# Altium schematic sheet rx_path.SchDoc: WULPUS PRO
size A3; DrawnBy: Sergei Vostrikov; Organization: Integrated Systems Laboratory; Revision: 1.0.0; SheetNumber: 2; SheetTotal: 8
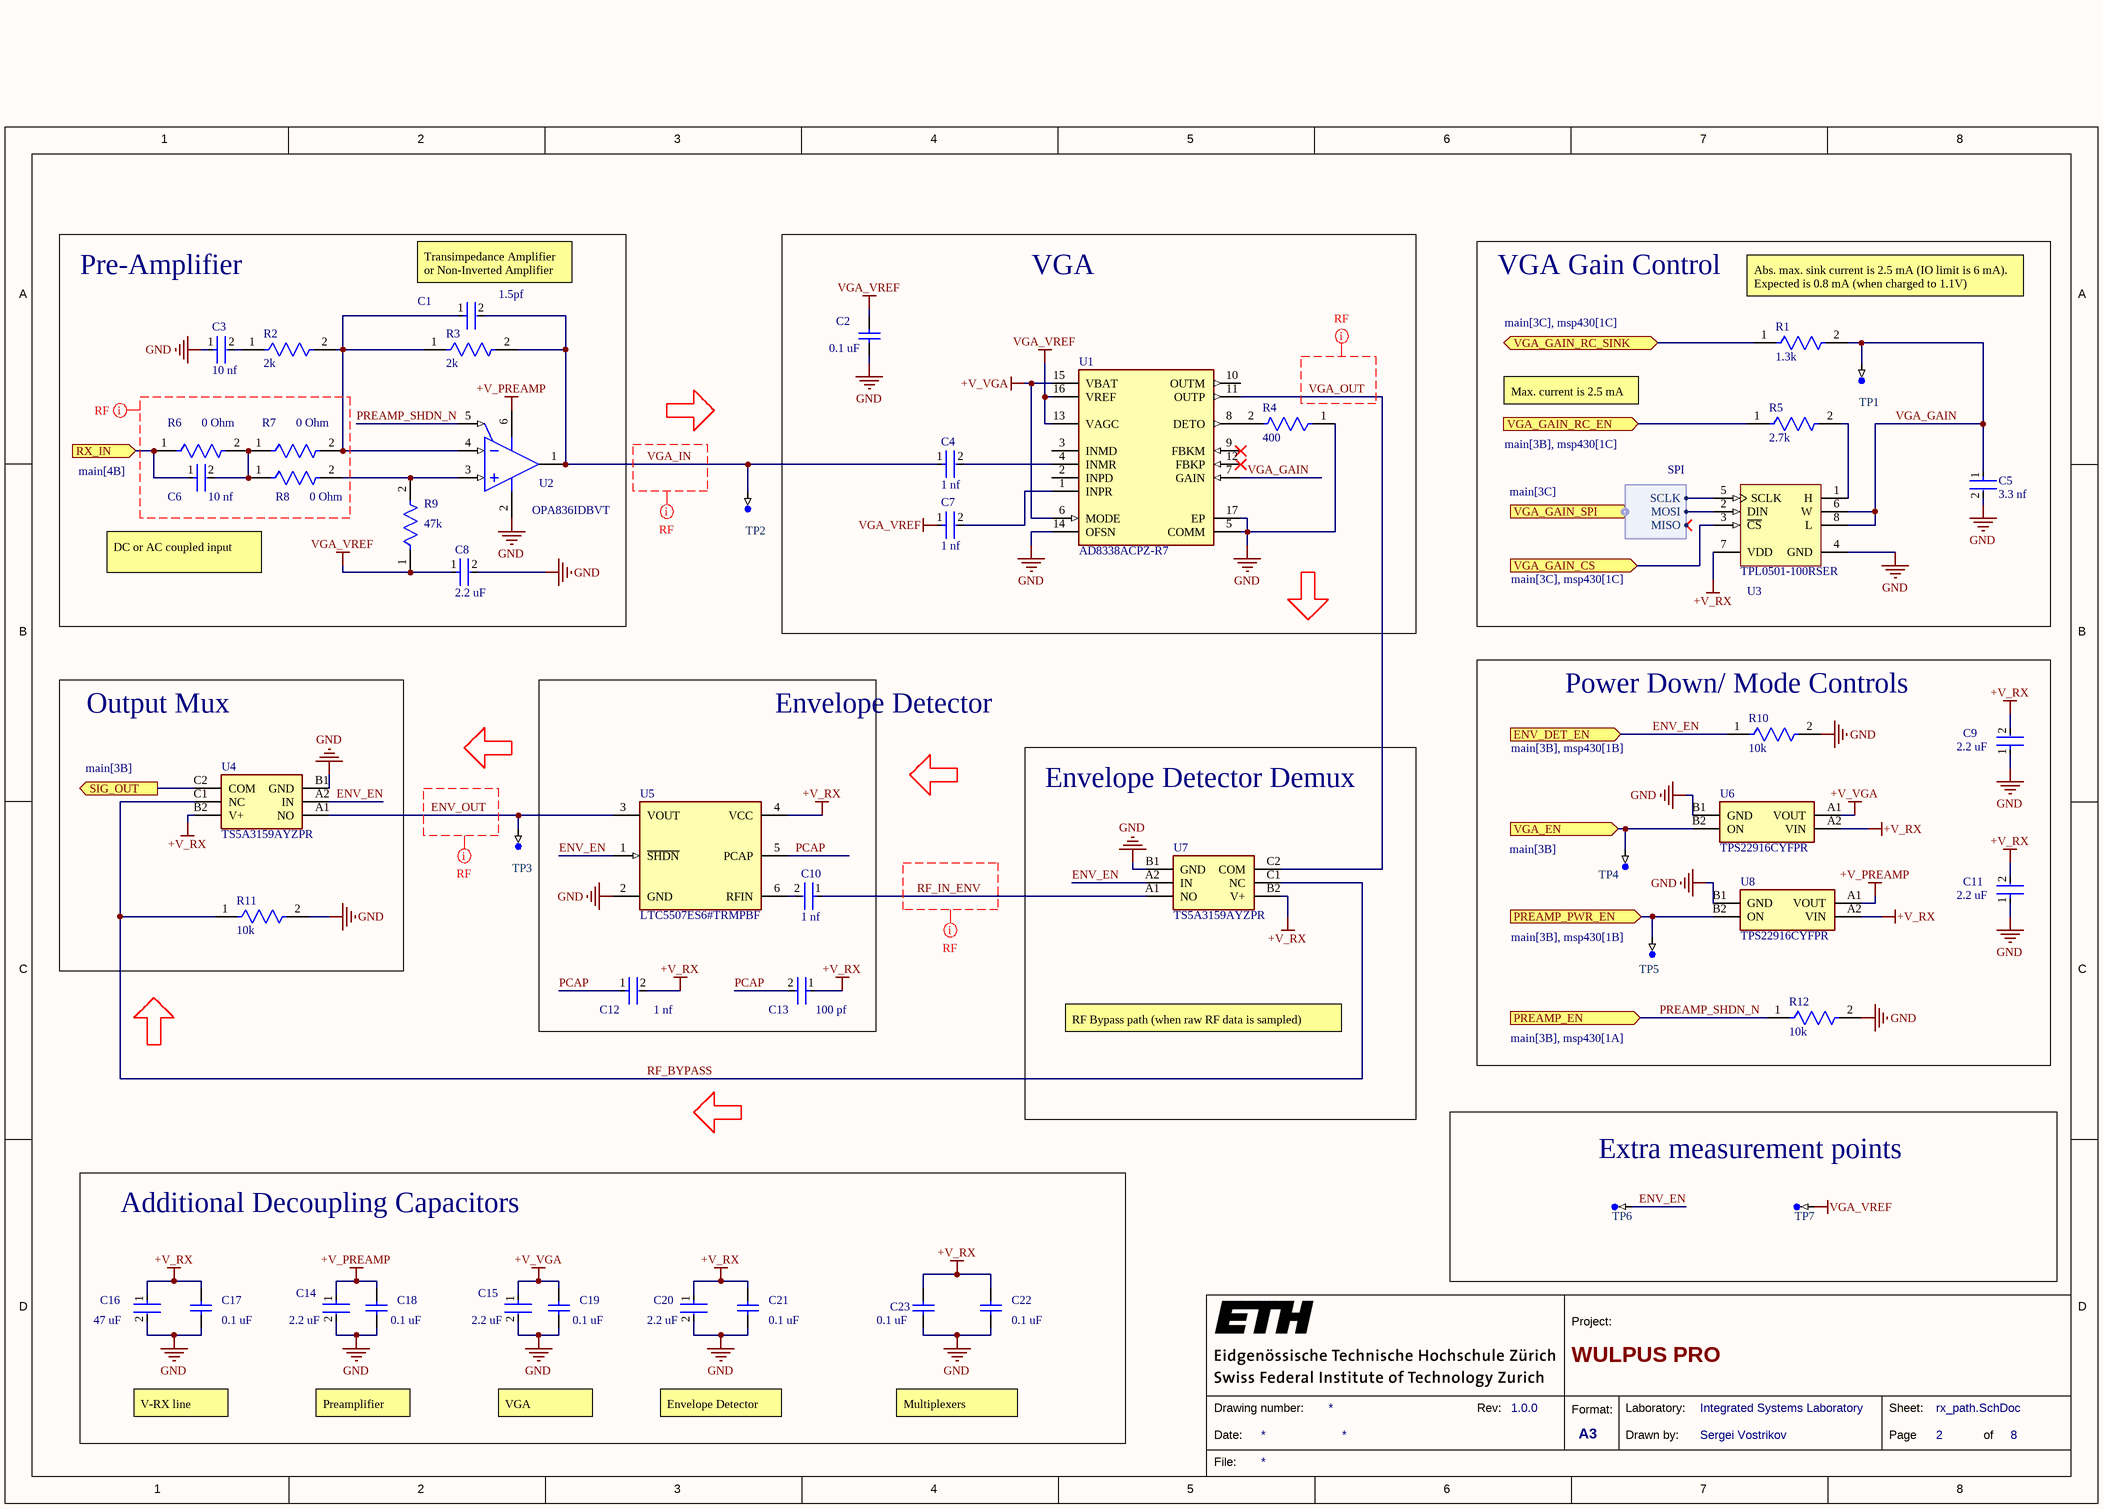
[diagram p0: rx_path.SchDoc]

## Parts
C1  1.5pf  [FP-GJM155-0_05-IPC_C]
C2  0.1 uF  [CAPC1005X55X30LL05T10]
C3  10 nf  [FP-GRM033-0_03-IPC_B]
C4  1 nf  [FP-GRM155-0_05-IPC_B]
C5  3.3 nf  [FP-0402-L_1_0_1-W_0_5_0_1-IPC_C]
C6  10 nf  [FP-GRM033-0_03-IPC_B]
C7  1 nf  [FP-GRM155-0_05-IPC_B]
C8  2.2 uF  [FP-C1005-050-0_15-0_1-MFG]
C9  2.2 uF  [FP-C1005-050-0_15-0_1-MFG]
C10  1 nf  [FP-GRM155-0_05-IPC_B]
C11  2.2 uF  [FP-C1005-050-0_15-0_1-MFG]
C12  1 nf  [FP-GRM155-0_05-IPC_B]
C13  100 pf  [FP-0402-L_1_0_1-W_0_5_0_1-MFG]
C14  2.2 uF  [FP-C1005-050-0_15-0_1-MFG]
C15  2.2 uF  [FP-C1005-050-0_15-0_1-MFG]
C16  47 uF  [FP-GRM188-0_2-MFG]
C17  0.1 uF  [CAPC1005X55X30LL05T10]
C18  0.1 uF  [CAPC1005X55X30LL05T10]
C19  0.1 uF  [CAPC1005X55X30LL05T10]
C20  2.2 uF  [FP-C1005-050-0_15-0_1-MFG]
C21  0.1 uF  [CAPC1005X55X30LL05T10]
C22  0.1 uF  [CAPC1005X55X30LL05T10]
C23  0.1 uF  [CAPC1005X55X30LL05T10]
R1  1.3k  [FP-CRCW0402-e3-IPC_B]
R2  2k  [FP-ERJ2RK-MFG]
R3  2k  [FP-ERJ2RK-MFG]
R4  400  [FP-CRCW0402-C-e3-MFG]
R5  2.7k  [FP-MCS0402-IPC_B]
R6  0 Ohm  [FP-CRCW0402-e3-IPC_C]
R7  0 Ohm  [FP-CRCW0402-e3-IPC_C]
R8  0 Ohm  [FP-CRCW0402-e3-IPC_C]
R9  47k  [FP-RMCF0201-MFG]
R10  10k  [FP-CRCW0402-e3-IPC_B]
R11  10k  [FP-CRCW0402-e3-IPC_B]
R12  10k  [FP-CRCW0402-e3-IPC_B]
TP1  TP-SM-C-100  [TP-SM-C-100]  (value not drawn)  (no BOM)
TP2  TP-SM-C-100  [TP-SM-C-100]  (value not drawn)  (no BOM)
TP3  TP-SM-C-100  [TP-SM-C-100]  (value not drawn)  (no BOM)
TP4  TP-SM-C-100  [TP-SM-C-100]  (value not drawn)  (no BOM)
TP5  TP-SM-C-100  [TP-SM-C-100]  (value not drawn)  (no BOM)
TP6  TP-SM-C-100  [TP-SM-C-100]  (value not drawn)  (no BOM)
TP7  TP-SM-C-100  [TP-SM-C-100]  (value not drawn)  (no BOM)
U1  AD8338ACPZ-R7  [FP-CP-16-22-IPC_C]
U2  OPA836IDBVT  [DBV0006A_L]
U3  TPL0501-100RSER  [TI-RSE8_V]
U4  TS5A3159AYZPR  [BGA6C50P2X3_89X139X50]
U5  LTC5507ES6#TRMPBF  [FP-LTC5507ES6#TRMPBF-IPC_B]
U6  TPS22916CYFPR  [BGA4C40P2X2_78X78X50]
U7  TS5A3159AYZPR  [BGA6C50P2X3_89X139X50]
U8  TPS22916CYFPR  [BGA4C40P2X2_78X78X50]

## Blocks framed on the sheet
Pre-Amplifier: C1 C3 C6 C8 R2 R3 R6-R9 U2
VGA: C2 C4 C7 R4 U1
VGA Gain Control: C5 R1 R5 TP1 U3
Power Down/ Mode Controls: C9 C11 R10 R12 TP4 TP5 U6 U8
Output Mux: R11 U4
Envelope Detector: C10 C12 C13 U5
Envelope Detector Demux: U7
Extra measurement points: TP6 TP7
Additional Decoupling Capacitors: C14-C23

## Ports
ENV_DET_EN (in, see main[3B], msp430[1B]), PREAMP_EN (in, see main[3B], msp430[1A]), PREAMP_PWR_EN (in, see main[3B], msp430[1B]), RX_IN (in, see main[4B]), SIG_OUT (out, see main[3B]), VGA_EN (in, see main[3B]), VGA_GAIN_CS (in, see main[3C], msp430[1C]), VGA_GAIN_RC_EN (in, see main[3B], msp430[1C]), VGA_GAIN_RC_SINK (bidir, see main[3C], msp430[1C]), VGA_GAIN_SPI (harness SPI, see main[3C])

## Harnesses
SPI: SCLK, MOSI, MISO

## Nets
+V_PREAMP: C14.1 C18.2 U2.6(VS+) U8.A1(VOUT)
+V_RX: C9.2 C11.2 C12.2 C13.1 C16.1 C17.2 C20.1 C21.2 C22.2 C23.2 U3.7(VDD) U4.B2(V+) U5.4(VCC) U6.A2(VIN) U7.B2(V+) U8.A2(VIN)
+V_VGA: C15.1 C19.2 U1.6(MODE) U1.15(VBAT) U6.A1(VOUT)
GND: C2.1 C3.1 C5.2 C8.2 C9.1 C11.1 C14.2 C15.2 C16.2 C17.1 C18.1 C19.1 C20.2 C21.1 C22.1 C23.1 R4.1 R10.2 R11.2 R12.2 U1.5(COMM) U1.14(OFSN) U1.17(EP) U2.2(VS-) U3.4(GND) U4.B1(GND) U5.2(GND) U6.B1(GND) U7.B1(GND) U8.B1(GND)
VGA_VREF: C2.2 C7.1 C8.1 R9.1 TP7.1 U1.13(VAGC) U1.16(VREF)
ENV_EN: R10.1 TP6.1 U4.A2(IN) U5.1(~{SHDN}) U7.A2(IN) ; port ENV_DET_EN
ENV_OUT: TP3.1 U4.A1(NO) U5.3(VOUT)
PCAP: C12.1 C13.2 U5.5(PCAP)
PREAMP_PWR_EN: TP5.1 U8.B2(ON) ; port PREAMP_PWR_EN
PREAMP_SHDN_N: R12.1 U2.5(~{PD}) ; port PREAMP_EN
RF_BYPASS: R11.1 U4.C1(NC) U7.C1(NC)
RF_IN_ENV: C10.1 U7.A1(NO)
RX_IN: C6.1 R6.1 ; port RX_IN
SIG_OUT: U4.C2(COM) ; port SIG_OUT
VGA_EN: TP4.1 U6.B2(ON) ; port VGA_EN
VGA_GAIN: C5.1 R1.2 TP1.1 U1.7(GAIN) U3.6(W) U3.8(L)
VGA_GAIN_CS: U3.3(~{CS}) ; port VGA_GAIN_CS
VGA_GAIN_RC_EN: R5.1 ; port VGA_GAIN_RC_EN
VGA_GAIN_RC_SINK: R1.1 ; port VGA_GAIN_RC_SINK
VGA_IN: C1.2 C4.1 R3.2 TP2.1 U2.1(VOUT)
VGA_OUT: U1.11(OUTP) U7.C2(COM)
NetC1_1: C1.1 R2.2 R3.1 R7.2 U2.4(VIN-)
NetC3_2: C3.2 R2.1
NetC4_2: C4.2 U1.4(INMR)
NetC6_2: C6.2 R6.2 R7.1 R8.1
NetC7_2: C7.2 U1.1(INPR)
NetC10_2: C10.2 U5.6(RFIN)
NetR4_2: R4.2 U1.8(DETO)
NetR5_2: R5.2 U3.1(H)
NetR8_2: R8.2 R9.2 U2.3(VIN+)
NetU3_2: U3.2(DIN) ; port VGA_GAIN_SPI.MOSI
NetU3_5: U3.5(SCLK) ; port VGA_GAIN_SPI.SCLK

Not connected (* = marked no-connect by the designer): U1 2(INPD) 3(INMD) 9(FBKM)* 10(OUTM) 12(FBKP)*

## Layout directives
net class RF: (no net found under the mark), ENV_OUT, RF_IN_ENV, VGA_IN, VGA_OUT

## Notes on the sheet
- (near C1) Transimpedance Amplifier or Non-Inverted Amplifier
- (near R1) Abs. max. sink current is 2.5 mA (IO limit is 6 mA). Expected is 0.8 mA (when charged to 1.1V)
- Max. current is 2.5 mA
- DC or AC coupled input
- RF Bypass path (when raw RF data is sampled)
- V-RX line
- Preamplifier
- VGA
- Envelope Detector
- Multiplexers
- 1
- 2
- 3
- 4
- 5
- 6
- 7
- 8
- A
- B
- C
- D
- Project:
- Date:
- Drawing number:
- Rev:
- Format:
- A3
- Drawn by:
- Laboratory:
- Page
- Sheet:
- of
- File:

## Library data of the parts
C1 = CMP-2008-03820-2: GJM1555C1H1R5BB01D; Temperature Coefficient: 30ppm/°C; Voltage Rating: 50V; Dielectric: C0G; Depth: 0.5mm; Case Code (Imperial): 0402; Package Quantity: 10000; Length: 1mm; Number of Pins: 2; Max Operating Temperature: 125°C; Mount: Surface Mount; Construction: Flat; Thickness: 0.022inch; Series: GJM; Packaging: Tape and Reel; Radiation Hardening: No; REACH SVHC: No SVHC; Case/Package: 0402; Lead Free: Lead Free; Voltage Rating (DC): 50V; Min Operating Temperature: -55°C; Termination: SMD/SMT; Width: 0.5mm; Capacitance: 1.5pF; Lead Pitch: 0.3mm; Case Code (Metric): 1005; Voltage: 50V; Height: 0.5mm
C2 C17-C19 C21-C23 = CMP-0001-00074-2: C0402C104K4RACTU; Manufacturer: Kemet; Part Number: C0402C104K4RACTU
C3 C6 = CMP-2010-01684-2: GRM033R71A103KA01D; Voltage: 10V; Capacitance: 10nF; Material: Ceramic; Dielectric: X7R; Tolerance: 10%; Package Quantity: 1; Width: 0.012inch; Mount: Surface Mount; Voltage Rating (DC): 10V; Voltage Rating: 10V; Length: 0.6mm; Packaging: Tape and Reel; REACH SVHC: No SVHC; Termination: SMD/SMT; Case/Package: 0201; Radiation Hardening: No; Height: 0.3mm; Case Code (Imperial): 0201; Min Operating Temperature: -55°C; Lead Free: Lead Free; Thickness: 0.013inch; Depth: 0.3mm; Case Code (Metric): 0603; Max Operating Temperature: 125°C
C4 C7 C10 C12 = CMP-2008-04254-2: GRM1555C1H102JA01D; Tolerance: 5%; Temperature Coefficient: 30ppm/°C; Insulation Resistance: 10GR; Material: Ceramic; Voltage Rating: 50V; Dielectric: C0G; Capacitance: 1nF; Packaging: Tape and Reel; Lead Free: Lead Free; Thickness: 0.022inch; Termination: SMD/SMT; Max Operating Temperature: 125°C; Height: 0.5mm; Package Quantity: 1; Radiation Hardening: No; Case Code (Metric): 1005; Number of Pins: 2; Mount: Surface Mount; Voltage: 50V; Case/Package: 0402; Min Operating Temperature: -55°C; Dielectric Material: Ceramic; Width: 0.5mm; Depth: 0.5mm; Case Code (Imperial): 0402; REACH SVHC: No SVHC; Voltage Rating (DC): 50V; Length: 1mm
C5 = CMP-2008-02911-2: 04025C332JAT2A; Dielectric: X7R; Capacitance: 3.3nF; Voltage Rating: 50V; Tolerance: 5%; Dissipation Factor: 2.5%; Length: 1mm; Number of Pins: 2; Width: 0.02inch; Case Code (Imperial): 0402; Contact Plating: Tin; Packaging: Tape and Reel; Height: 0.56mm; Case/Package: 0402; Termination: SMD/SMT; Construction: Flat; Max Operating Temperature: 125°C; Min Operating Temperature: -55°C; RoHS Compliant: Yes; Case Code (Metric): 1005; Mount: Surface Mount; Package Quantity: 1; Series: -; REACH SVHC: No SVHC; Lead Free: Lead Free; Voltage Rating (DC): 50V; Radiation Hardening: No; Depth: 0.5mm; Thickness: 0.022inch
C8 C9 C11 C14 C15 C20 = CMP-08246-004344-1: C1005X7S1A225K050BC; Capacitance: 2.2uF; Dielectric: X7S; Dielectric Material: Ceramic; Voltage Rating: 10V; Tolerance: 10%; Mount: Surface Mount; Height: 0.5mm; Package Quantity: 1; Depth: 0.5mm; RoHS Compliant: Yes; Length: 1mm; Thickness: 0.022inch; Packaging: Tape and Reel; Case Code (Imperial): 0402; Resistor Type: Ceramic; Case/Package: 0402; Min Operating Temperature: -55°C; Series: C; Weight: 2.3E-05oz; Width: 0.02inch; Voltage Rating (DC): 10V; Case Code (Metric): 1005; Max Operating Temperature: 125°C; Termination: SMD/SMT; Lead Free: Lead Free
C13 = CMP-2008-02567-2: 04025A101FAT2A; Dielectric: C0G; Capacitance: 100pF; Voltage: 50V; Tolerance: 1%; Dielectric Material: Ceramic; Packaging: Tape and Reel; Thickness: 0.022inch; Termination: SMD/SMT; Case Code (Imperial): 0402; Case Code (Metric): 1005; Width: 0.02inch; Radiation Hardening: No; Min Operating Temperature: -55°C; Depth: 0.5mm; Number of Pins: 2; Height: 0.56mm; REACH SVHC: No SVHC; Case/Package: 0402; Voltage Rating: 50V; Length: 1mm; Mount: Surface Mount; Max Operating Temperature: 125°C; Package Quantity: 1; Lead Free: Lead Free; Voltage Rating (DC): 50V
C16 = CMP-00260-117335223-1: GRM188R60J476ME01D; Material: Ceramic; Tolerance: 20%; Voltage Rating (DC): 6.3V; Dielectric: X5R; Capacitance: 47µF; Case/Package: 0603; Width: 800µm; Min Operating Temperature: -55°C; Lifecycle Status: Production; Height: 1mm; Length: 1.6mm; Max Operating Temperature: 85°C; Voltage Rating: 6.3V; NexarPartId: 117335223; Thickness: 800µm
R1 = CMP-1011-00077-3: CRCW04021K30JNED; Tolerance: 5%; Voltage Rating (DC): 50V; Resistance: 1.3kR; Power Rating: 63mW; Temperature Coefficient: 200ppm/°C; Height: 0.016inch; Military Standard: Not; Max Operating Temperature: 155°C; Width: 0.5mm; Features: Automotive AEC-Q200; Depth: 0.5mm; Weight: 2.3E-05oz; Contact Plating: Tin; Case Code (Imperial): 0402; Min Operating Temperature: -55°C; Voltage Rating: 50V; Package Quantity: 1; Lead Free: Lead Free; Case/Package: 0402; Packaging: Tape and Reel; Radiation Hardening: No; Length: 1mm; Case Code (Metric): 1005; Number of Terminations: 2; Max Power Dissipation: 63mW; Composition: Thick Film
R2 R3 = CMP-2002-00758-4: ERJ-2RKF2001X; Temperature Coefficient: 100ppm/°C; Max Power Dissipation: 100mW; Working Voltage: 50V; Resistance: 2kR; Tolerance: 1%; Number of Terminations: 2; Technology: THICK FILM; Packaging: Tape and Reel; RoHS Compliant: Yes; Min Operating Temperature: -55°C; Length: 1mm; Construction: Rectangular; Features: Automotive AEC-Q200; Contact Plating: Tin; Lead Free: Lead Free; Series: ERJ; Power Rating: 100mW; REACH SVHC: No SVHC; Resistor Type: Thick Film; Max Operating Temperature: 155°C; Package Quantity: 10000; Height: 0.35mm; Case/Package: 0402; Mount: Surface Mount; Termination: SMD/SMT; Resistance Tolerance: 1%; Depth: 0.5mm; Voltage Rating (DC): 50V; Voltage Rating: 50V; Case Code (Imperial): 0402; Military Standard: Not; Width: 0.02inch; Radiation Hardening: No; Case Code (Metric): 1005
R4 = CMP-00030-23798141-1: CRCW04021R00FKEDC; Resistance: 1Ω; Tolerance: 1%; Temperature Coefficient: 100ppm/°C; Voltage Rating: 50V; Power Rating: 63mW; Lead Free: Lead Free; Case/Package: 0402; Max Operating Temperature: 155°C; RoHS: Compliant; Height: 350µm; Schedule B: 8533210045, 8533210045; Composition: Thick Film; NexarPartId: 23798141; Min Operating Temperature: -55°C
R5 = CMP-02407-008611-1: MCS04020C2701FE000; Resistance: 2.7kR; Tolerance: 1%; Temperature Coefficient: 50ppm/°C; Max Power Dissipation: 100mW; Number of Terminations: 2; Packaging: Tape and Reel; Package Quantity: 10000; Height: 0.015inch; Length: 0.039inch; Max Operating Temperature: 125°C; Military Standard: Not; Min Operating Temperature: -55°C; Composition: Thin Film; Width: 0.02inch; Depth: 0.5mm; Contact Plating: Tin; Radiation Hardening: No; Case/Package: 0402; Lead Free: Lead Free
R6-R8 = CMP-2002-08122-2: CRCW04020000Z0ED; Tolerance: 5%; Max Power Dissipation: 63mW; Voltage Rating: 50V; Temperature Coefficient: 100ppm/°C; Resistance: 0mR; Contact Plating: Tin; Height: 0.35mm; Radiation Hardening: No; Features: Automotive AEC-Q200; Composition: Thick Film; Width: 0.5mm; Weight: 2.3E-05oz; Termination: SMD/SMT; Packaging: Tape and Reel; Mount: Surface Mount; Case Code (Metric): 1005; Military Standard: Not; Min Operating Temperature: -55°C; Number of Terminations: 2; Package Quantity: 1; Case Code (Imperial): 0402; Depth: 0.5mm; Max Operating Temperature: 155°C; Case/Package: 0402; Power Rating: 63mW; Lead Free: Lead Free; Voltage Rating (DC): 50V; Length: 1mm
R9 = CMP-26527-004787-1: RMCF0201JT47K0; Power Rating: 50mW; Resistance: 47kR; Tolerance: 5%; Temperature Coefficient: 200ppm/°C; Length: 0.024inch; RoHS Compliant: Yes; Max Operating Temperature: 125°C; Width: 0.012inch; Case Code (Metric): 0603; Height: 0.009inch; Case Code (Imperial): 0201; Mount: Surface Mount; Case/Package: 0201; Radiation Hardening: No; Number of Terminations: 2; Min Operating Temperature: -55°C; Series: RMCF; Contact Plating: Tin; Package Quantity: 10000; Packaging: Tape and Reel; Max Power Dissipation: 50mW; Resistor Type: Thick Film
R10-R12 = CMP-2002-08136-3: CRCW040210K0JNED; Temperature Coefficient: 200ppm/°C; Voltage Rating: 50V; Power Rating: 63mW; Resistance: 10kR; Tolerance: 5%; Military Standard: Not; Packaging: Tape and Reel; Case Code (Imperial): 0402; Min Operating Temperature: -55°C; Case Code (Metric): 1005; Case/Package: 0402; Termination: SMD/SMT; Composition: Thick Film; Depth: 0.5mm; Number of Terminations: 2; Contact Plating: Tin; Height: 0.016inch; Width: 0.5mm; Max Operating Temperature: 155°C; Features: Automotive AEC-Q200; Length: 1mm; Radiation Hardening: No; Max Power Dissipation: 63mW; Mount: Surface Mount; Package Quantity: 1; Weight: 2.3E-05oz
TP1-TP7 = CMP-0484-00002-1: Test Point, Surface Mount, Circular, Pad Diameter 1 mm
U1 = CMP-09116-000032-1: IC OPAMP VGA 1 CIRCUIT 16LFCSP; Manufacturer: Analog Devices; Nominal Supply Current: 3-6mA; Max Supply Voltage: 5V; Number Of Channels: 1; Output Current Per Channel: 5mA; Max Junction Temp: +150°C; Min Supply Voltage: 3V; Bandwidth: 18MHz; Voltage Gain: 80dB; Mouser Description: Special Purpose Amplifiers Ultra Low Pwr 18MHz SGL CH VGA; Device Class L2: Linear ICs; Ipc Land Pattern Name: QFN50P300X300X75-16; Temperature Range Low: -40°C; Device Class L1: Integrated Circuits (ICs); RoHS: TRUE; Digikey Description: IC OPAMP VGA 1 CIRCUIT 16LFCSP; Category: IC; ComponentLink2URL: https://www.analog.com/media/en/technical-documentation/data-sheets/AD8338.pdf; Automotive: No; Height: 0.8mm; Manufacturer Part Number: AD8338ACPZ-R7; Octopart: https://octopart.com/ad8338acpz-r7-analog+devices-21054770; Temperature: -40°C to +85°C; ComponentLink2Description: Datasheet; Lead Free: Yes; Temperature Range High: +85°C; Package: CP-16-22; Device Class L3: Amplifiers - Op Amps
U2 = CMP-0018-00480-2: Very Low Power, Rail to Rail Out, Negative Rail In, VFB Operational Amplifier, 2.5 to 5.5 V, -40 to 125 degC, 6-pin SOT23 (DBV6), Green (RoHS & no Sb/Br); Manufacturer: Texas Instruments; Iq per channel(Max)(mA): 1; Settling Time (0.1%)(Typ)(ns): 30; Vs(Min)(V): 2.5; Vio(Max)(mV): 0.4; 3rd Harmonic(dBc): 105; BW @ Acl(MHz): 205; Vs(Max)(V): 5.5; 2nd Harmonic(dBc): 85; Sub Family: Audio Operational Amplifier, High Output Current Amplifier (>=50mA), High Speed Amplifier (>=50MHz), Low Noise Amp (<=10nV/rtHz), Low Offset Voltage Amplifier (<=500uV), Low Supply Voltage Amplifier (<=2.7V); Vn at Flatband(Typ)(nV/rtHz): 4.6; Iib(Max)(nA): 1000; Slew Rate(Typ)(V/us): 560; Io(Typ)(mA): 50; Number of Channels: 1; Eco-Plan: Green (RoHS & no Sb/Br); PartNumber: OPA836IDBVT; ComponentLink3URL: http://www.ti.com/litv/pdf/mpds026h; ComponentLink3Description: Package Specification; @ MHz: 1; ComponentLink1Description: Manufacturer URL; ComponentLink2URL: http://www.ti.com/general/docs/lit/getliterature.tsp?genericPartNumber=OPA836&fileType=pdf; Acl, min stable gain(V/V): 1; PackageVersion: 4073253-5/K, 03/2006; PackageDescription: 6-Pin Plastic Small Outline, Body 1.6 x 2.9 mm, Pitch 0.95 mm; ComponentLink1URL: http://www.ti.com/; ComponentLink2Description: Datasheet; PackageReference: DBV0006A; Code_JEDEC: MO-178; DatasheetVersion: SLOS712D; Mounting Technology: Surface Mount
U3 = CMP-0004-01511-1: 256-Tap, 100 k, Single Channel Potentiometer with SPI Interface, -40 to 125 degC, 8-pin QFN (RSE8), Green (RoHS & no Sb/Br); Manufacturer: Texas Instruments; Settling Time(us): 3; SubFamily: Digital Potentiometer; DNL(Max)(+/-LSB): 0.5; DAC Channels: 1; PackageVersion: 4207268-2/D, 01/2011; PackageDescription: 8-Pin Plastic Quad Flatpack No-Pin, 1.5 x 1.5 mm Body, 0.5 mm Pitch; ComponentLink3Description: Package Specification; ComponentLink3URL: http://www.ti.com/litv/pdf/mpqf207b; ComponentLink2Description: Datasheet; INL(Max)(+/-LSB): 1; ComponentLink2URL: http://www.ti.com/general/docs/lit/getliterature.tsp?genericPartNumber=TPL0501-100&fileType=pdf; DatasheetVersion: SLIS136A; PackageReference: RSE8; Eco-Plan: Green (RoHS & no Sb/Br); ComponentLink1URL: http://www.ti.com/; PartNumber: TPL0501-100RSER; ComponentLink1Description: Manufacturer URL; Interface: SPI; Code_JEDEC: MO-288; Mounting Technology: Surface Mount
U4 U7 = TS5A3159AYZPR: Analogue Switch ICs SPDT ANALOG SWITCH; Manufacturer_Name: Texas Instruments; Geometry.Height: 0.5mm; Manufacturer_Part_Number: TS5A3159AYZPR; Arrow Part Number: TS5A3159AYZPR; Arrow Price/Stock: https://www.arrow.com/en/products/ts5a3159ayzpr/texas-instruments?utm_currency=USD&region=nac; Datasheet Link: https://www.ti.com/lit/ds/symlink/ts5a3159a.pdf?ts=1623385377964&ref_url=https%253A%252F%252Fwww.ti.com%252Fproduct%252FTS5A3159A
U5 = CMP-09141-000004-1: IC RF DETECT 100KHZ-1GHZ TSOT23; Manufacturer: Analog Devices; Standoff Height: 0.01mm; Max Junction Temp: +125°C; Max Frequency: 1000MHz; Bandwidth: 999.9MHz; Temperature Range Low: -40°C; ComponentLink2URL: https://www.analog.com/media/en/technical-documentation/data-sheets/5507f.pdf; Automotive: No; Device Class L2: RF Semiconductors and Devices; Height: 1mm; RoHS: TRUE; Mouser Description: RF Detector 0.1MHz to 1000MHz 14dBm Automotive 6-Pin TSOT-23 T/R; Lead Free: Yes; Temperature Range High: +85°C; Device Class L3: unset; Category: IC; Octopart: https://octopart.com/ltc5507es6%23trmpbf-analog+devices-88320008; Digikey Description: IC RF DETECT 100KHZ-1GHZ TSOT23; Package: TSOT-23; Temperature: -40°C to +85°C; ComponentLink2Description: Datasheet; Device Class L1: Integrated Circuits (ICs); Manufacturer Part Number: LTC5507ES6#TRMPBF; Ipc Land Pattern Name: SOT95P280X91-6
U6 U8 = TPS22916CYFPR: TPS22916 5.5-V, 2-A Ultra-Low Leakage Load Switch; Manufacturer_Name: Texas Instruments; Geometry.Height: 0.5mm; Manufacturer_Part_Number: TPS22916CYFPR; Arrow Part Number: TPS22916CYFPR; Arrow Price/Stock: https://www.arrow.com/en/products/tps22916cyfpr/texas-instruments?utm_currency=USD&region=nac; Datasheet Link: http://www.ti.com/lit/gpn/tps22916